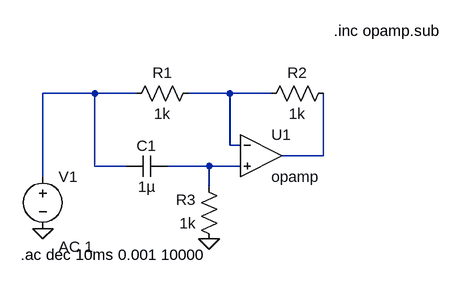
[diagram p0: schematic Draft.asc]
Draft.asc, the LTspice schematic file:
Version 4
SHEET 1 880 680
WIRE 0 144 -80 144
WIRE 64 144 0 144
WIRE 208 144 144 144
WIRE 272 144 208 144
WIRE 208 224 208 144
WIRE 224 224 208 224
WIRE 352 240 352 144
WIRE 352 240 288 240
WIRE 0 256 0 144
WIRE 48 256 0 256
WIRE 176 256 112 256
WIRE 224 256 176 256
WIRE -80 272 -80 144
WIRE 176 288 176 256
FLAG 176 368 0
FLAG -80 352 0
SYMBOL OpAmps\\opamp 256 176 R0
SYMATTR InstName U1
SYMBOL res 160 128 R90
WINDOW 0 0 56 VBottom 2
WINDOW 3 32 56 VTop 2
SYMATTR InstName R1
SYMATTR Value 1k
SYMBOL res 368 128 R90
WINDOW 0 0 56 VBottom 2
WINDOW 3 32 56 VTop 2
SYMATTR InstName R2
SYMATTR Value 1k
SYMBOL res 192 384 R180
WINDOW 0 36 76 Left 2
WINDOW 3 36 40 Left 2
SYMATTR InstName R3
SYMATTR Value 1k
SYMBOL cap 112 240 R90
WINDOW 0 0 32 VBottom 2
WINDOW 3 32 32 VTop 2
SYMATTR InstName C1
SYMATTR Value 1µ
SYMBOL voltage -80 256 R0
WINDOW 123 24 124 Left 2
WINDOW 39 0 0 Left 0
SYMATTR InstName V1
SYMATTR Value ""
SYMATTR Value2 AC 1
TEXT -114 392 Left 2 !.ac dec 10ms 0.001 10000
TEXT 368 48 Left 2 !.inc opamp.sub

The netlist it stands for:
* Draft.asc
XU1 N002 N004 N003 opamp Aol=100K GBW=10Meg  ; pins invin noninvin out
R1 N002 N001 1k
R2 N003 N002 1k
R3 0 N004 1k
C1 N004 N001 1µ
V1 N001 0 AC 1
.ac dec 10ms 0.001 10000
.inc opamp.sub
.backanno
.end